# Altium schematic sheet Regulators.SchDoc
size A; SheetNumber: 6; SheetTotal: 6
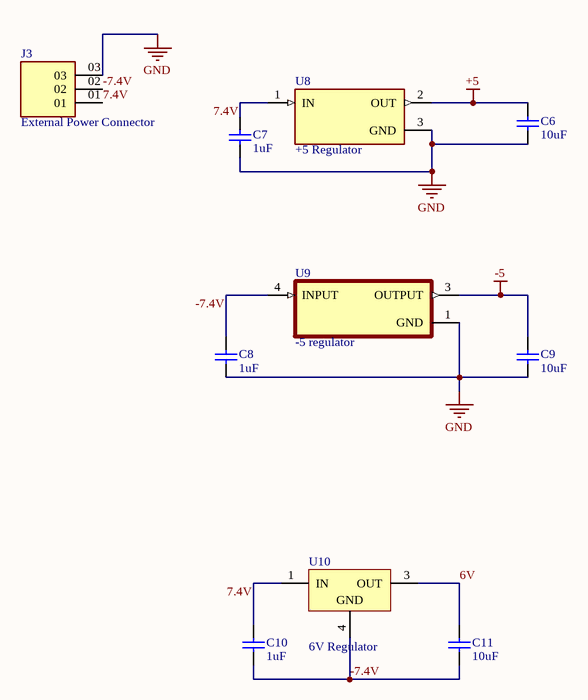
[diagram p0: Regulators.SchDoc]

## Parts
C6  10uF  [CAPC2013X135X45ML10T25]
C7  1uF  [CAPC2013X135X45ML10T25]
C8  1uF  [CAPC2013X135X45ML10T25]
C9  10uF  [CAPC2013X135X45ML10T25]
C10  1uF  [CAPC2013X135X45ML10T25]
C11  10uF  [CAPC2013X135X45ML10T25]
J3  External Power Connector  [SAMTEC_HTSW-103-XX-X-S]
U8  +5 Regulator  [TO254P1542X460-3N]
U9  -5 regulator  [VREG_L7805ACD2T]
U10  6V Regulator  [TO-263_L]

## Nets
+5: C6.2 U8.2(OUT)
-5: C9.2 U9.3(OUTPUT)
GND: C6.1 C7.1 C8.1 C9.1 J3.03 U8.3(GND) U9.1(GND)
6V: C11.2 U10.3(OUT)
7.4V: C7.2 C10.2 J3.01 U8.1(IN) U10.1(IN)
-7.4V: C8.2 C10.1 C11.1 J3.02 U9.4(INPUT) U10.4(GND)

## Library data of the parts
C6 C9 C11 = 10uF: GRM21BR60J106KE19L; Manufacturer: Murata; Part Number: GRM21BR60J106KE19L
C7 C8 C10 = 1uF: Multilayer Ceramic Capacitor, 1 uF, +/- 10%, 16 V, -55 to 125 degC, 0805 (2012 Metric), RoHS, Tape and Reel; GRM21BR71C105KA01L; Manufacturer: Murata; Dielectric: X7R; Capacitance: 1µF; Rated Voltage: 16V; Package Description: 2-Pin Surface Mount Device, Body 2 x 1.25 mm; Datasheet Version: Mar-08; Package Reference: 805; Datasheet URL: https://datasheet.ciiva.com/34302/1858922-34302874.pdf; Case Size/Dimension: 0805; Tolerance (%): ±10%; Manufacturer URL: http://www.murata.com/
J3 = HTSW-103-XX-X-S: MF: Samtec; Package: None; Price: None; Value: *; MP: HTSW-103-XX-X-S; Availability: Unavailable
U8 = L7805CD2T-TR: Linear Voltage Regulator IC Positive Fixed 1 Output 1.5A D2PAK; MF: STMicroelectronics; SnapEDA_Link: https://www.snapeda.com/parts/L7805CD2T-TR/STMicroelectronics/view-part/?ref=snap; Package: TO-263-3 STMicroelectronics; Value: *; MP: L7805CD2T-TR; Check_prices: https://www.snapeda.com/parts/L7805CD2T-TR/STMicroelectronics/view-part/?ref=eda
U9 = L7905CD2T-TR: Linear Voltage Regulator IC Negative Fixed 1 Output 1.5A D2PAK; MF: STMicroelectronics; SnapEDA_Link: https://www.snapeda.com/parts/L7905CD2T-TR/STMicroelectronics/view-part/?ref=snap; Package: TO-263-3 STMicroelectronics; Value: *; MP: L7905CD2T-TR; Check_prices: https://www.snapeda.com/parts/L7905CD2T-TR/STMicroelectronics/view-part/?ref=eda
U10 = 6V Regulator: Positive Voltage Regulator, 3-Pin D2PAK, Tape and Reel; L7806CD2T-TR; PackageDescription: 3-Pin Transistor Outline Package 2.54 mm Pitch, 15.4 mm Lead Span (D2PAK); ComponentLink1Description: Manufacturer URL; ComponentLink2URL: http://www.st.com/internet/com/TECHNICAL_RESOURCES/TECHNICAL_LITERATURE/DATASHEET/CD00000444.pdf; ComponentLink1URL: http://www.st.com; ComponentLink2Description: Datasheet; DatasheetVersion: 16/11/2011; PackageReference: TO-263; PackageVersion: 2011